# EAGLE design motherboard (EAGLE 5.06)
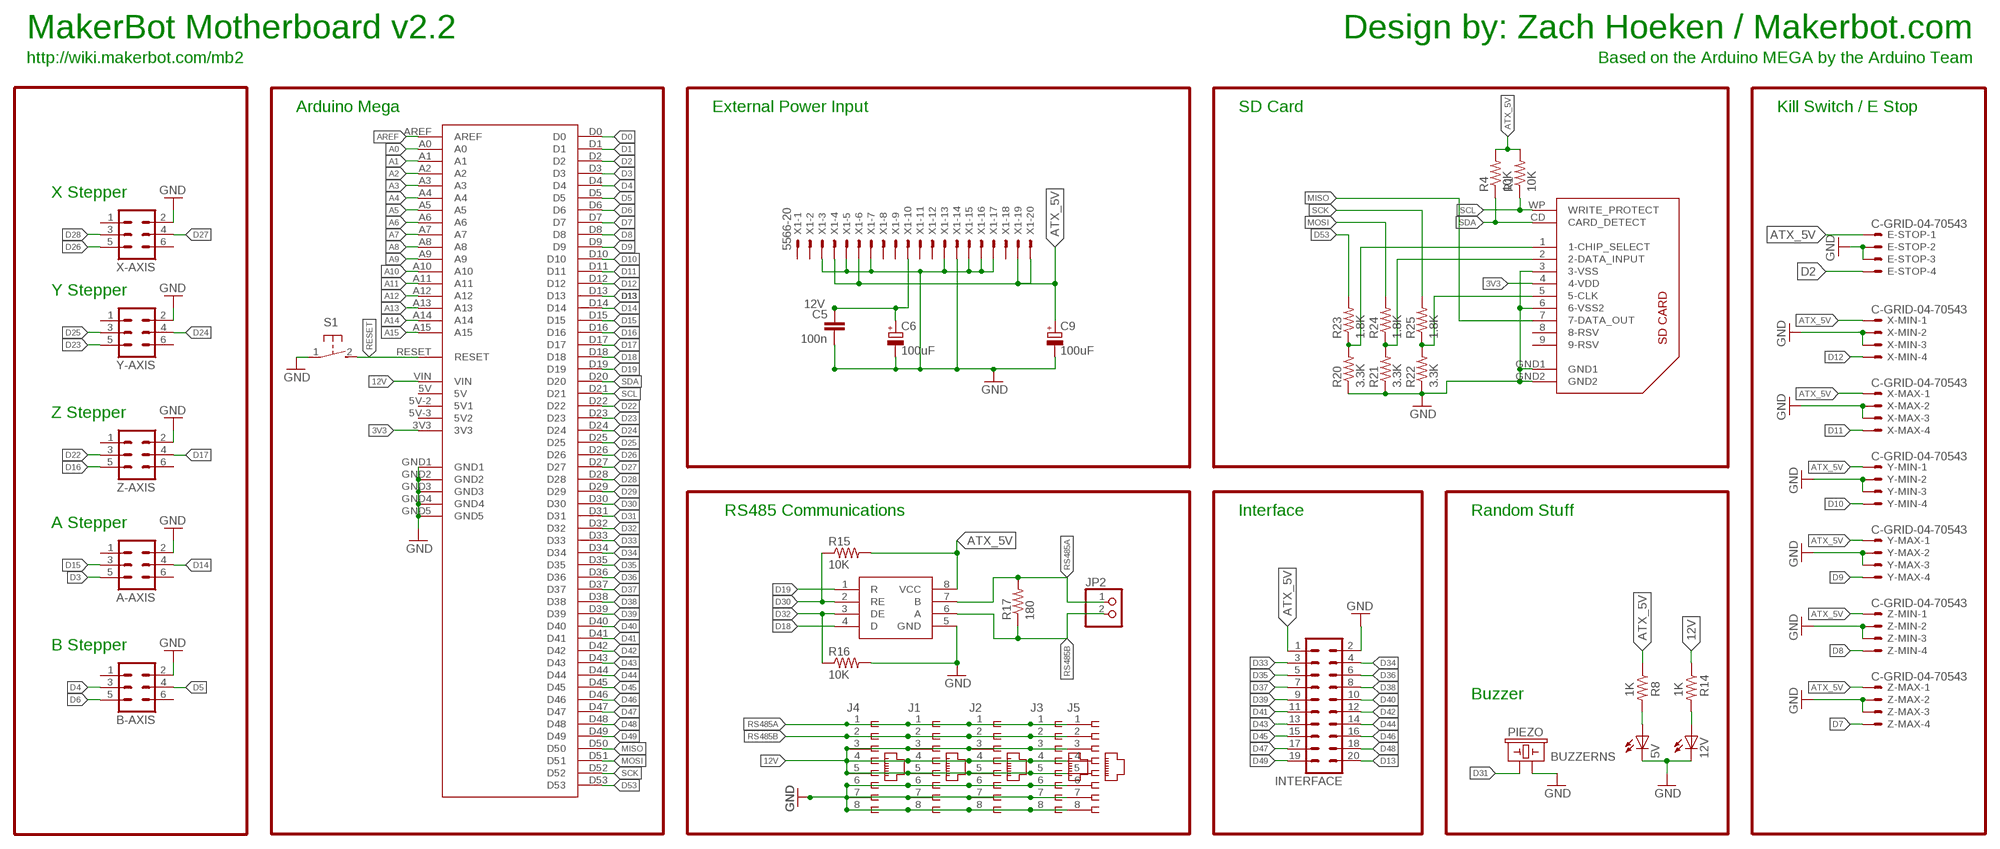
[diagram p0: schematic, sheet 1]

## Parts
5V  LED0805  [LED-0805]
12V  LED0805  [LED-0805]
A-AXIS  ML6  [ML6]
B-AXIS  ML6  [ML6]
C5  100n  CAP0805  [0805]
C6  100uF  CPOL-EUE3.5-8  [E3,5-8]
C9  100uF  CPOL-EUE3.5-8  [E3,5-8]
E-STOP  C-GRID-04-70543  [70543-04]
IC1  SN75176ASOIC  [SO08]
INTERFACE  ML20  [ML20]
J1  556416-1  [556416-1]
J2  556416-1  [556416-1]
J3  556416-1  [556416-1]
J4  556416-1  [556416-1]
J5  556416-1  [556416-1]
JP2  PINHD-1X2  [1X02]
PIEZO  BUZZERNS  [BUZZER-12MM-NS]
R1  10K  RESISTOR  [0805]
R4  10K  RESISTOR  [0805]
R8  1K  RESISTOR  [0805]
R14  1K  RESISTOR  [0805]
R15  10K  RESISTOR  [0805]
R16  10K  RESISTOR  [0805]
R17  180  RESISTOR  [0805]
R20  3.3K  RESISTOR  [0805]
R21  3.3K  RESISTOR  [0805]
R22  3.3K  RESISTOR  [0805]
R23  1.8K  RESISTOR  [0805]
R24  1.8K  RESISTOR  [0805]
R25  1.8K  RESISTOR  [0805]
S1  31-XX  [B3F-31XX]
U$1  ARDUINO-MEGA  [ARDUINO-MEGA]
U$2  SDCARD  [3M-SDCARD]
X1  5566-20  [5566-20]
X-AXIS  ML6  [ML6]
X-MAX  C-GRID-04-70543  [70543-04]
X-MIN  C-GRID-04-70543  [70543-04]
Y-AXIS  ML6  [ML6]
Y-MAX  C-GRID-04-70543  [70543-04]
Y-MIN  C-GRID-04-70543  [70543-04]
Z-AXIS  ML6  [ML6]
Z-MAX  C-GRID-04-70543  [70543-04]
Z-MIN  C-GRID-04-70543  [70543-04]

## Nets
3V3: U$1.3V3 U$2.4(4-VDD)
12V [power]: C5.1 C6.+ J1.3 J1.4 J1.5 J2.3 J2.4 J2.5 J3.3 J3.4 J3.5 J4.3 J4.4 J4.5 J5.3 J5.4 J5.5 R14.1 U$1.VIN X1.10
A0: U$1.A0
A1: U$1.A1
A2: U$1.A2
A3: U$1.A3
A4: U$1.A4
A5: U$1.A5
A6: U$1.A6
A7: U$1.A7
A8: U$1.A8
A9: U$1.A9
A10: U$1.A10
A11: U$1.A11
A12: U$1.A12
A13: U$1.A13
A14: U$1.A14
A15: U$1.A15
AREF: U$1.AREF
ATX_5V [usbvcc]: C9.+ E-STOP.1 IC1.8(VCC) INTERFACE.1 R1.2 R4.2 R8.1 R15.2 X1.4 X1.6 X1.19 X1.20 X-MAX.1 X-MIN.1 Y-MAX.1 Y-MIN.1 Z-MAX.1 Z-MIN.1
D0: U$1.D0
D1: U$1.D1
D2: E-STOP.4 U$1.D2
D3: A-AXIS.5 U$1.D3
D4: B-AXIS.3 U$1.D4
D5: B-AXIS.4 U$1.D5
D6: B-AXIS.5 U$1.D6
D7: U$1.D7 Z-MAX.4
D8: U$1.D8 Z-MIN.4
D9: U$1.D9 Y-MAX.4
D10: U$1.D10 Y-MIN.4
D11: U$1.D11 X-MAX.4
D12: U$1.D12 X-MIN.4
D13: INTERFACE.20 U$1.D13
D14: A-AXIS.4 U$1.D14
D15: A-AXIS.3 U$1.D15
D16: U$1.D16 Z-AXIS.5
D17: U$1.D17 Z-AXIS.4
D18: IC1.4(D) U$1.D18
D19: IC1.1(R) U$1.D19
D22: U$1.D22 Z-AXIS.3
D23: U$1.D23 Y-AXIS.5
D24: U$1.D24 Y-AXIS.4
D25: U$1.D25 Y-AXIS.3
D26: U$1.D26 X-AXIS.5
D27: U$1.D27 X-AXIS.4
D28: U$1.D28 X-AXIS.3
D29: U$1.D29
D30: IC1.2(RE) R15.1 U$1.D30
D31: PIEZO.+ U$1.D31
D32: IC1.3(DE) R16.1 U$1.D32
D33: INTERFACE.3 U$1.D33
D34: INTERFACE.4 U$1.D34
D35: INTERFACE.5 U$1.D35
D36: INTERFACE.6 U$1.D36
D37: INTERFACE.7 U$1.D37
D38: INTERFACE.8 U$1.D38
D39: INTERFACE.9 U$1.D39
D40: INTERFACE.10 U$1.D40
D41: INTERFACE.11 U$1.D41
D42: INTERFACE.12 U$1.D42
D43: INTERFACE.13 U$1.D43
D44: INTERFACE.14 U$1.D44
D45: INTERFACE.15 U$1.D45
D46: INTERFACE.16 U$1.D46
D47: INTERFACE.17 U$1.D47
D48: INTERFACE.18 U$1.D48
D49: INTERFACE.19 U$1.D49
D53: R23.2 U$1.D53
GND [gnd]: 5V.C 12V.C A-AXIS.2 B-AXIS.2 C5.2 C6.- C9.- E-STOP.2 E-STOP.3 IC1.5(GND) INTERFACE.2 J1.6 J1.7 J1.8 J2.6 J2.7 J2.8 J3.6 J3.7 J3.8 J4.6 J4.7 J4.8 J5.6 J5.7 J5.8 PIEZO.- R16.2 R20.1 R21.1 R22.1 S1.1(P) U$1.GND1 U$1.GND2 U$1.GND3 U$1.GND4 U$1.GND5 U$2.3(3-VSS) U$2.6(6-VSS2) U$2.GND1 U$2.GND2 X1.3 X1.5 X1.7 X1.13 X1.14 X1.15 X1.16 X1.17 X-AXIS.2 X-MAX.2 X-MAX.3 X-MIN.2 X-MIN.3 Y-AXIS.2 Y-MAX.2 Y-MAX.3 Y-MIN.2 Y-MIN.3 Z-AXIS.2 Z-MAX.2 Z-MAX.3 Z-MIN.2 Z-MIN.3
MISO: U$1.D50 U$2.7(7-DATA_OUT)
MOSI: R24.2 U$1.D51
N$3: 5V.A R8.2
N$4: R22.2 R25.1 U$2.5(5-CLK)
N$5: R21.2 R24.1 U$2.2(2-DATA_INPUT)
N$10: 12V.A R14.2
N$11: R20.2 R23.1 U$2.1(1-CHIP_SELECT)
RESET: S1.2(S) U$1.RESET
RS485A: IC1.7(B) J1.1 J2.1 J3.1 J4.1 J5.1 JP2.1 R17.2
RS485B: IC1.6(A) J1.2 J2.2 J3.2 J4.2 J5.2 JP2.2 R17.1
SCK: R25.2 U$1.D52
SCL: R1.1 U$1.D21 U$2.WP(WRITE_PROTECT)
SDA: R4.1 U$1.D20 U$2.CD(CARD_DETECT)
Unconnected: A-AXIS.1 A-AXIS.6 B-AXIS.1 B-AXIS.6 U$1.5V U$1.5V-2(5V1) U$1.5V-3(5V2) U$2.8(8-RSV) U$2.9(9-RSV) X1.1 X1.2 X1.8 X1.9 X1.11 X1.12 X1.18 X-AXIS.1 X-AXIS.6 Y-AXIS.1 Y-AXIS.6 Z-AXIS.1 Z-AXIS.6

## Notes on the sheet
- Design by: Zach Hoeken / Makerbot.com
- MakerBot Motherboard v2.2
- Based on the Arduino MEGA by the Arduino Team
- http://wiki.makerbot.com/mb2
- Arduino Mega | External Power Input | SD Card | Kill Switch / E Stop
- X Stepper
- Y Stepper
- Z Stepper
- RS485 Communications | Interface | Random Stuff
- A Stepper
- B Stepper
- Buzzer

## Library data of the parts
5V 12V = SparkFun:LED: LEDs Standard schematic elements and footprints for 5mm, 3mm, 1206, and 0603 sized LEDs. 5mm - Spark Fun Electronics SKU : COM-00529 (and others)
A-AXIS B-AXIS X-AXIS Y-AXIS Z-AXIS = con-ml:ML6: HARTING
C5 = SparkFun:CAP: Capacitor Standard 0603 ceramic capacitor, and 0.1" leaded capacitor.
C6 C9 = resistor:CPOL-EU: POLARIZED CAPACITOR, European symbol
E-STOP X-MAX X-MIN Y-MAX Y-MIN Z-MAX Z-MIN = con-molex:C-GRID-04: CONNECTOR wire to board 2.54 mm (0.100") pitch header
IC1 = reprap:SN75176A
INTERFACE = con-harting-ml:ML20: HARTING
J1-J5 = con-amp:556416-1: AMP connector
JP2 = pinhead:PINHD-1X2: PIN HEADER
PIEZO = SparkFun:BUZZER: Buzzer 12mm Spark Fun Electronics SKU : Comp-Buzzer
R1 R4 R8 R14-R17 R20-R25 = SparkFun:RESISTOR: Resistor Basic schematic elements and footprints for 0603, 1206, and PTH 1/10th watt (small) resistors.
S1 = switch-omron:31-XX: OMRON SWITCH
U$1 = MakerBot:ARDUINO-MEGA
U$2 = reprap:SDCARD
X1 = con-molex:5566-20: Mini FIT connector 20 pol ATX PC-Motherboard Power connector Source: http://www.molex.com

## Net classes
0 default: width 0.203 mm, drill 0.406 mm, clearance 0.203 mm
1 power: width 0.61 mm, drill 0.711 mm, clearance 0.203 mm
2 gnd: width 0.305 mm, drill 0.711 mm, clearance 0.203 mm
3 usbvcc: width 0.508 mm, drill 0.711 mm, clearance 0.203 mm

## Board
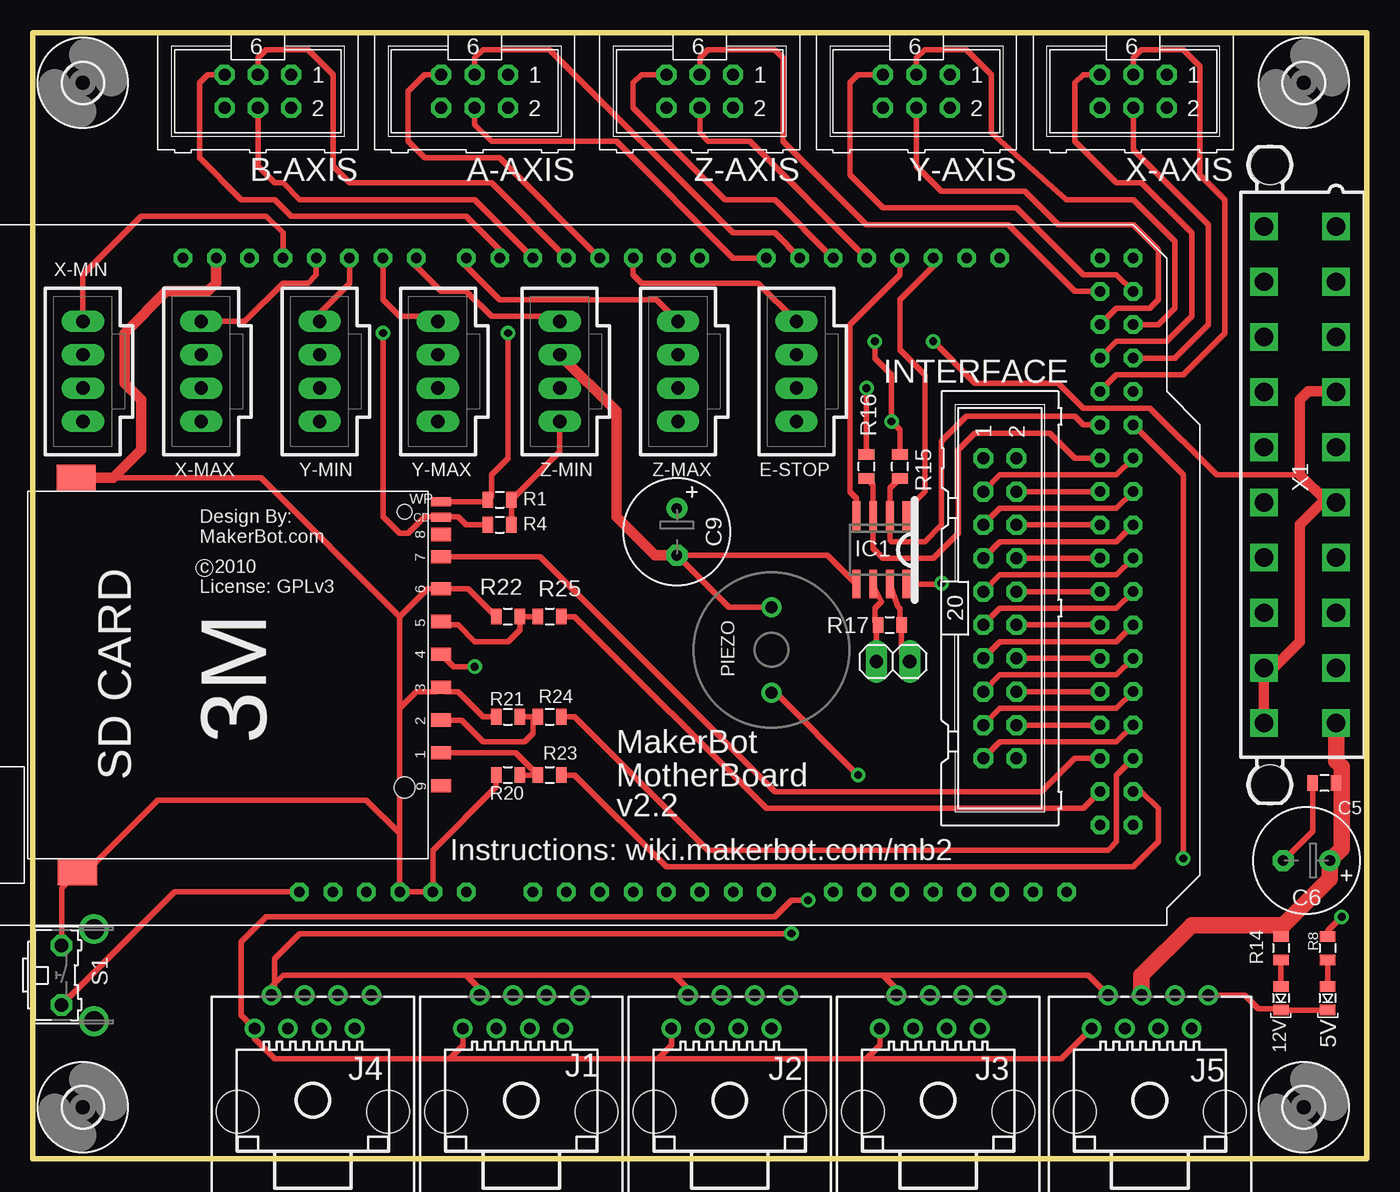
[diagram p1: board, top side]
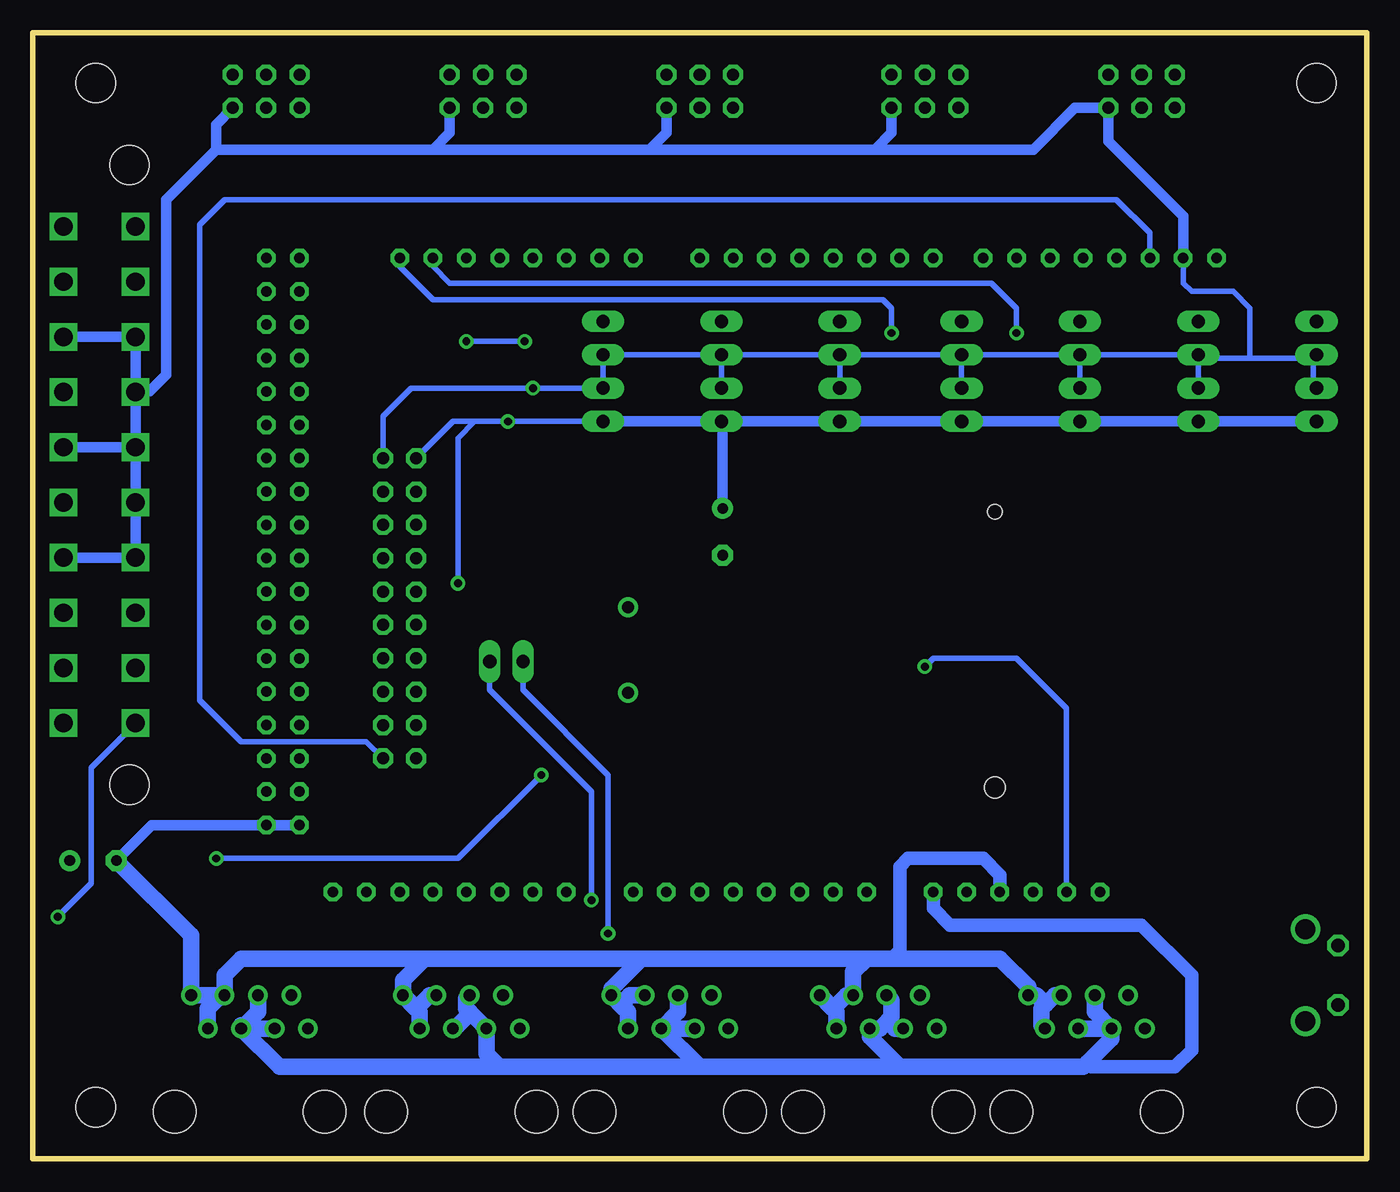
[diagram p2: board, bottom side, seen from below]

Size 101.6 x 85.72 mm. Coordinates in mm from the lower left corner, seen from the top.
Outline: 0,0 101.6,0 101.6,85.72 0,85.72 0,0
Copper layers (1*16): Top 0.035mm / dielectric 1.5mm / Bottom 0.035mm
Design rules "SparkFun": minimum track width 8mil, minimum drill 20mil, track to track 8mil, track to pad 8mil, pad to pad 8mil, via to via 8mil, smd to smd 8mil, copper to edge 10mil, drill to drill 8mil, minimum pad ring 12mil, minimum via ring 10mil, stop-mask expansion 4mil, vias tented up to drill 25mil, thermal gap 10mil

### Footprints (pad centres in the part's own frame; a part is rotated, then mirrored left to right if it is on the bottom)
LED-0805 = smd 1.2 x 0.8: A 0,-0.9; C 0,0.9
ML6 = drill 0.914 octagon: 1 -2.54,-1.27; 2 -2.54,1.27; 3 0,-1.27; 4 0,1.27; 5 2.54,-1.27; 6 2.54,1.27
0805 = smd 0.8 x 1.2: 1 -0.9,0; 2 0.9,0
E3,5-8 = drill 0.813 pad 1.6 round: + -1.778,0 | drill 0.813 pad 1.6 octagon: - 1.778,0
70543-04 = drill 1.016 long: 1 -3.81,0; 2 -1.27,0; 3 1.27,0; 4 3.81,0
SO08 = smd 0.6 x 2.2: 1 -1.905,-2.6; 2 -0.635,-2.6; 3 0.635,-2.6; 4 1.905,-2.6; 5 1.905,2.6; 6 0.635,2.6; 7 -0.635,2.6; 8 -1.905,2.6
ML20 = drill 0.914 octagon: 1 -11.43,-1.27; 2 -11.43,1.27; 3 -8.89,-1.27; 4 -8.89,1.27; 5 -6.35,-1.27; 6 -6.35,1.27; 7 -3.81,-1.27; 8 -3.81,1.27; 9 -1.27,-1.27; 10 -1.27,1.27; 11 1.27,-1.27; 12 1.27,1.27; 13 3.81,-1.27; 14 3.81,1.27; 15 6.35,-1.27; 16 6.35,1.27; 17 8.89,-1.27; 18 8.89,1.27; 19 11.43,-1.27; 20 11.43,1.27
556416-1 = drill 0.889 round: 1 -4.445,5.461; 2 -3.175,8.001; 3 -1.905,5.461; 4 -0.635,8.001; 5 0.635,5.461; 6 1.905,8.001; 7 3.175,5.461; 8 4.445,8.001 | hole 3.251: -5.715,-0.889; 5.715,-0.889
1X02 = drill 1.016 long: 1 -1.27,0; 2 1.27,0
BUZZER-12MM-NS = drill 0.9 round: + 3.25,0; - -3.25,0
B3F-31XX = drill 1.016 octagon: 1 -2.261,-1.245; 2 2.261,-1.245 | drill 1.499 pad 2.159 round: 3 -3.505,1.245; 4 3.505,1.245
ARDUINO-MEGA = drill 0.8 octagon: 3V3 35.56,2.54; 5V 93.98,50.8; 5V-2 96.52,50.8; 5V-3 38.1,2.54; A0 50.8,2.54; A1 53.34,2.54; A2 55.88,2.54; A3 58.42,2.54; A4 60.96,2.54; A5 63.5,2.54; A6 66.04,2.54; A7 68.58,2.54; A8 73.66,2.54; A9 76.2,2.54; A10 78.74,2.54; A11 81.28,2.54; A12 83.82,2.54; A13 86.36,2.54; A14 88.9,2.54; A15 91.44,2.54; AREF 24.13,50.8; D0 63.5,50.8; D1 60.96,50.8; D2 58.42,50.8; D3 55.88,50.8; D4 53.34,50.8; D5 50.8,50.8; D6 48.26,50.8; D7 45.72,50.8; D8 41.91,50.8; D9 39.37,50.8; D10 36.83,50.8; D11 34.29,50.8; D12 31.75,50.8; D13 29.21,50.8; D14 68.58,50.8; D15 71.12,50.8; D16 73.66,50.8; D17 76.2,50.8; D18 78.74,50.8; D19 81.28,50.8; D20 83.82,50.8; D21 86.36,50.8; D22 93.98,48.26; D23 96.52,48.26; D24 93.98,45.72; D25 96.52,45.72; D26 93.98,43.18; D27 96.52,43.18; D28 93.98,40.64; D29 96.52,40.64; D30 93.98,38.1; D31 96.52,38.1; D32 93.98,35.56; D33 96.52,35.56; D34 93.98,33.02; D35 96.52,33.02; D36 93.98,30.48; D37 96.52,30.48; D38 93.98,27.94; D39 96.52,27.94; D40 93.98,25.4; D41 96.52,25.4; D42 93.98,22.86; D43 96.52,22.86; D44 93.98,20.32; D45 96.52,20.32; D46 93.98,17.78; D47 96.52,17.78; D48 93.98,15.24; D49 96.52,15.24; D50 93.98,12.7; D51 96.52,12.7; D52 93.98,10.16; D53 96.52,10.16; GND1 26.67,50.8; GND2 93.98,7.62; GND3 96.52,7.62; GND4 40.64,2.54; GND5 43.18,2.54; RESET 33.02,2.54; VIN 45.72,2.54
3M-SDCARD = smd 1 x 1.5: 1 5.93,16.5; 2 3.43,16.5; 3 0.93,16.5; 4 -1.57,16.5; 5 -4.07,16.5; 6 -6.57,16.5; 7 -9,16.5; 8 -10.7,16.5; 9 8.43,16.5 | smd 0.7 x 1.5: CD -12,16.5; WP -13.2,16.5 | smd 2 x 3: GND1 -15,-11.3; GND2 15,-11.2 | hole 1.1: -12.427,13.705 | hole 1.6: 8.567,13.708
3,0 = hole 3: 0,0
5566-20 = drill 1.4 square: 1 18.9,-2.75; 2 14.7,-2.75; 3 10.5,-2.75; 4 6.3,-2.75; 5 2.1,-2.75; 6 -2.1,-2.75; 7 -6.3,-2.75; 8 -10.5,-2.75; 9 -14.7,-2.75; 10 -18.9,-2.75; 11 18.9,2.75; 12 14.7,2.75; 13 10.5,2.75; 14 6.3,2.75; 15 2.1,2.75; 16 -2.1,2.75; 17 -6.3,2.75; 18 -10.5,2.75; 19 -14.7,2.75; 20 -18.9,2.75 | hole 3: 23.6,2.29; -23.6,2.29

### Placement (x,y rotation side)
5V  98.63,12.22 180 top
12V  95.07,12.22 180 top
A-AXIS  33.66,81.28 180 top
B-AXIS  17.14,81.28 180 top
C5  98.38,28.6 180 top
C6  97.01,22.7 180 top
C9  49.05,47.73 270 top
E-STOP  58.17,59.94 90 top
IC1  64.64,46.35 180 top
INTERFACE  73.66,41.91 270 top
J1  37.21,4.45 0 top
J2  53.09,4.45 0 top
J3  68.96,4.45 0 top
J4  21.34,4.45 0 top
J5  85.09,4.45 0 top
JP2  65.53,37.85 180 top
PIEZO  56.26,38.73 270 top
R1  35.56,50.16 0 top
R4  35.56,48.26 0 top
R8  98.63,16.03 270 top
R14  95.07,16.03 270 top
R15  66.04,52.7 90 top
R16  63.5,52.7 90 top
R17  65.28,40.64 0 top
R20  36.2,29.21 0 top
R21  36.2,33.66 0 top
R22  36.2,41.27 0 top
R23  39.37,29.21 0 top
R24  39.37,33.66 0 top
R25  39.37,41.27 0 top
S1  3.43,13.97 270 top
U$1  -12.7,17.78 0 top
U$2  14.61,36.83 270 top
U$4  [3,0]  3.81,81.92 0 top
U$5  [3,0]  96.81,81.92 0 top
U$6  [3,0]  96.81,3.92 0 top
U$7  [3,0]  3.81,3.92 0 top
X1  96.52,52.07 90 top
X-AXIS  83.82,81.28 180 top
X-MAX  12.83,59.94 90 top
X-MIN  3.81,59.94 90 top
Y-AXIS  67.31,81.28 180 top
Y-MAX  30.86,59.94 90 top
Y-MIN  21.84,59.94 90 top
Z-AXIS  50.8,81.28 180 top
Z-MAX  49.15,59.94 90 top
Z-MIN  40.13,59.94 90 top

### Tracks (layer width: path | path; a pad name or v marks a point on that pad's centre or on a via)
3V3  (via drill 0.6)
  Top 0.406: v33.66,37.47 32.04,37.47 U$2.4
  Bottom 0.406: U$1.3V3 22.86,34.29 26.67,38.1 33.02,38.1 v33.66,37.47
12V
  Top 0.406: C5.1 99.28,28.79 99.69,29.21 | R14.1 95.07,17.6 95.25,17.78
  Top 1.27: X1.10 99.27,30.27 99.69,29.84 99.69,29.21 99.69,23.61 C6.+ 98.79,21.32 95.25,17.78 88.27,17.78 84.45,13.97 J5.4
  Bottom 1.016: U$1.VIN 33.02,19.05 31.75,17.78 17.14,17.78 13.34,13.97 13.34,8.26 14.61,6.99 20.95,6.99 21.27,7.3
  Bottom 1.27: J4.3 19.43,9.14 21.27,7.3 21.59,6.99 35.56,6.99 | 35.56,6.99 50.8,6.99 | 50.8,6.99 66.04,6.99 | 66.04,6.99 82.8,6.99 J5.5 | J5.5 J5.3 | J5.5 85.72,10.16 | 68.26,11.11 J3.3 67.06,8 66.04,6.99 | 68.26,11.11 68.58,11.43 68.58,12.19 J3.4 | J3.5 69.47,9.91 68.26,11.11 | J2.4 52.45,11.18 J2.5 | J2.5 J2.3 | 50.8,6.99 J2.5 | 36.51,10.48 37.08,9.91 J1.5 37.85,9.27 35.56,6.99 | 36.51,10.48 36.2,10.79 36.2,12.06 J1.4 | J1.3 35.94,9.91 36.51,10.48 | J4.4 20.7,11.18 J4.3 | J4.3 J4.5 | J5.4 84.45,11.18 J5.5
ATX_5V  (via drill 0.6)
  Top 0.406: Z-MIN.1 40.13,53.84 R1.2 R4.2 | R15.2 66.04,55.5 v65.41,56.13 65.41,59.69 64.14,60.96 v64.14,62.23 | R8.1 98.63,17.35 v99.69,18.41 | IC1.8 69.16,43.76 v69.22,43.81 | 96.52,52.07 90.17,52.07 85.09,57.15 80.01,57.15 78.11,59.05 71.75,59.05 v68.58,62.23
  Top 0.813: X1.20 X1.19 94.52,37.37 96.52,39.37 96.52,48.26 98.42,50.16 99.08,50.16 X1.6 98.62,49.97 96.52,52.07 96.52,57.78 97.16,58.42 99.22,58.42 X1.4
  Bottom 0.406: 67.94,56.13 v65.41,56.13 E-STOP.1 | 67.94,56.13 69.6,56.13 INTERFACE.1 | v99.69,18.41 97.16,20.95 97.16,29.79 X1.20 | v69.22,43.81 69.22,54.86 67.94,56.13 | v64.14,62.23 v68.58,62.23
  Bottom 0.813: X-MIN.1 X-MAX.1 Y-MIN.1 Y-MAX.1 Z-MIN.1 Z-MAX.1 | Z-MAX.1 E-STOP.1 | C9.+ 49.05,56.04 Z-MAX.1
D2
  Top 0.406: U$1.D2 45.72,67.31 46.35,66.67 55.24,66.67 E-STOP.4
D3
  Top 0.406: U$1.D3 35.56,76.2 29.84,76.2 28.57,77.47 28.57,81.28 29.84,82.55 A-AXIS.5
D4
  Top 0.406: U$1.D4 34.92,74.3 24.13,74.3 22.86,75.56 22.86,82.55 20.95,84.45 17.78,84.45 17.14,83.82 B-AXIS.3
D5
  Top 0.406: U$1.D5 33.66,73.03 20.32,73.03 19.05,74.3 18.41,74.3 17.14,75.56 B-AXIS.4
D6
  Top 0.406: U$1.D6 35.56,69.22 33.02,71.75 19.68,71.75 18.41,73.03 15.88,73.03 12.7,76.2 12.7,81.92 13.34,82.55 B-AXIS.5
D7
  Top 0.406: U$1.D7 33.02,67.94 35.56,65.41 47.5,65.41 Z-MAX.4
D8
  Top 0.406: U$1.D8 29.21,67.94 31.11,66.04 33.02,66.04 34.92,64.14 39.75,64.14 Z-MIN.4
D9
  Top 0.406: U$1.D9 26.67,65.41 27.94,64.14 30.48,64.14 Y-MAX.4
D10
  Top 0.406: Y-MIN.4 21.84,64.39 24.13,66.67 U$1.D10
D11
  Top 0.406: X-MAX.4 16.13,63.75 19.05,66.67 20.95,66.67 21.59,67.31 U$1.D11
D12
  Top 0.406: X-MIN.4 3.81,67.31 8.26,71.75 17.78,71.75 19.05,70.48 U$1.D12
D13
  Bottom 0.406: U$1.D13 16.51,70.48 19.05,73.03 87,73.03 88.9,71.12 88.9,34.92 85.72,31.75 76.2,31.75 INTERFACE.20
D14
  Top 0.406: U$1.D14 53.34,68.58 44.45,77.47 34.92,77.47 33.66,78.74 A-AXIS.4
D15
  Top 0.406: U$1.D15 56.52,70.48 53.34,70.48 39.37,84.45 34.29,84.45 33.66,83.82 A-AXIS.3
D16
  Top 0.406: U$1.D16 56.52,73.03 52.7,73.03 45.72,80.01 45.72,81.92 46.35,82.55 Z-AXIS.5
D17
  Top 0.406: U$1.D17 54.61,77.47 51.44,77.47 50.8,78.11 Z-AXIS.4
D18
  Top 0.406: U$1.D18 66.04,67.31 62.23,63.5 62.23,50.8 62.74,50.29 IC1.4
D19
  Top 0.406: U$1.D19 68.58,67.94 66.04,65.41 66.04,61.59 67.94,59.69 67.94,50.8 66.55,49.4 IC1.1
D22
  Top 0.406: U$1.D22 79.38,66.04 74.3,71.12 63.5,71.12 57.15,77.47 57.15,83.82 56.52,84.45 51.44,84.45 50.8,83.82 Z-AXIS.3
D23
  Top 0.406: Y-AXIS.5 62.87,82.55 62.23,81.92 62.23,74.93 64.77,72.39 74.93,72.39 80.01,67.31 82.55,67.31 U$1.D23
D24
  Top 0.406: U$1.D24 82.55,64.77 85.09,64.77 85.72,65.41 85.72,69.22 83.82,71.12 78.11,71.12 75.56,73.66 69.22,73.66 67.31,75.56 Y-AXIS.4
D25
  Top 0.406: U$1.D25 85.72,63.5 87,64.77 87,69.85 83.82,73.03 78.74,73.03 73.03,78.11 73.03,82.55 71.12,84.45 67.94,84.45 67.31,83.82 Y-AXIS.3
D26
  Top 0.406: U$1.D26 82.55,62.23 86.36,62.23 88.27,64.14 88.27,70.48 84.45,74.3 82.55,74.3 79.38,77.47 79.38,81.92 80.01,82.55 X-AXIS.5
D27
  Top 0.406: U$1.D27 87,60.96 89.53,63.5 89.53,71.12 83.82,76.83 X-AXIS.4
D28
  Top 0.406: U$1.D28 82.55,59.69 87.63,59.69 90.81,62.87 90.81,73.03 88.9,74.93 88.9,83.19 87.63,84.45 84.45,84.45 83.82,83.82 X-AXIS.3
D30
  Top 0.406: U$1.D30 80.01,55.88 79.38,56.52 71.12,56.52 69.22,54.61 69.22,48.26 67.94,46.99 65.41,46.99 65.28,47.12 IC1.2 65.28,51.04 R15.1
D31  (via drill 0.6)
  Top 0.406: PIEZO.+ 56.59,35.48 v62.87,29.21 | v87.63,22.86 87.63,52.07 U$1.D31
  Bottom 0.406: v62.87,29.21 69.22,22.86 v87.63,22.86
D32
  Top 0.406: U$1.D32 79.38,53.34 77.47,55.24 71.75,55.24 70.48,53.98 70.48,47.62 68.58,45.72 64.77,45.72 64.01,46.48 IC1.3 64.01,51.3 R16.1
D33
  Top 0.406: INTERFACE.3 73.66,52.07 82.55,52.07 U$1.D33
D34
  Top 0.406: INTERFACE.4 U$1.D34
D35
  Top 0.406: INTERFACE.5 73.66,49.53 82.55,49.53 U$1.D35
D36
  Top 0.406: INTERFACE.6 U$1.D36
D37
  Top 0.406: INTERFACE.7 73.66,46.99 82.55,46.99 U$1.D37
D38
  Top 0.406: INTERFACE.8 U$1.D38
D39
  Top 0.406: INTERFACE.9 73.66,44.45 82.55,44.45 U$1.D39
D40
  Top 0.406: INTERFACE.10 U$1.D40
D41
  Top 0.406: INTERFACE.11 73.66,41.91 82.55,41.91 U$1.D41
D42
  Top 0.406: INTERFACE.12 U$1.D42
D43
  Top 0.406: INTERFACE.13 73.66,39.37 82.55,39.37 U$1.D43
D44
  Top 0.406: INTERFACE.14 U$1.D44
D45
  Top 0.406: INTERFACE.15 73.66,36.83 82.55,36.83 U$1.D45
D46
  Top 0.406: INTERFACE.16 U$1.D46
D47
  Top 0.406: INTERFACE.17 73.66,34.29 82.55,34.29 U$1.D47
D48
  Top 0.406: INTERFACE.18 U$1.D48
D49
  Top 0.406: INTERFACE.19 73.66,31.75 82.55,31.75 U$1.D49
D53
  Top 0.406: U$1.D53 84.45,27.94 85.72,26.67 85.72,24.13 83.82,22.23 48.26,22.23 41.27,29.21 R23.2
GND  (via drill 0.6)
  Top 0.406: R22.1 33.17,43.4 U$2.6 30.07,43.4 27.94,41.27 | R21.1 34.29,33.66 32.38,35.56 31.45,35.56 U$2.3 30.77,35.56 29.21,35.56 27.94,34.29 | R20.1 35.3,28.31 30.48,23.5 U$1.GND5 U$1.GND4 27.94,24.77 | 27.94,24.77 27.94,34.29 | 27.94,34.29 27.94,41.27 | U$2.GND1 17.39,51.83 27.94,41.27 | 27.94,24.77 25.4,27.3 9.53,27.3 4.05,21.83 U$2.GND2 2.18,20.61 S1.1 | v63.5,58.67 R16.2 | C5.2 97.48,24.95 C6.- | 5V.C 12V.C 94.96,11.43 93.34,11.43 92.33,12.45 J5.8 | IC1.5 60.54,45.95 C9.- 53.02,41.98 PIEZO.-
  Top 0.813: C9.- 47.39,45.95 44.45,48.9 44.45,56.9 Z-MIN.3 | U$2.GND1 6.11,51.83 8.26,53.98 8.26,57.78 6.99,59.05 6.99,62.87 10.16,66.04 13.34,66.04 13.97,66.67 U$1.GND1
  Bottom 0.406: X-AXIS.2 86.17,80.01 | U$1.GND1 13.97,66.67 13.34,66.04 10.16,66.04 8.89,64.77 8.89,60.96 | 8.89,60.96 4.06,60.96 | 4.06,60.96 X-MIN.3 | 8.89,60.96 12.57,60.96 X-MAX.3 13.34,61.21 | 13.34,61.21 Y-MIN.3 | Y-MIN.3 Y-MAX.3 | Y-MAX.3 Z-MIN.3 | Z-MIN.3 Z-MAX.3 | Z-MAX.3 E-STOP.3 E-STOP.2 v63.5,58.67 71.12,58.67 72.77,58.67 74.93,56.52 INTERFACE.2 | 4.06,60.96 4.06,58.93 X-MIN.2 | X-MAX.2 12.83,60.71 13.34,61.21 | Y-MIN.3 Y-MIN.2 | Y-MAX.3 Y-MAX.2 | Z-MIN.3 Z-MIN.2 | Z-MAX.3 Z-MAX.2
  Bottom 0.813: U$1.GND2 U$1.GND3 92.53,25.4 C6.- | X1.7 X1.17 X1.16 X1.15 | X1.15 X1.5 | X1.14 X1.15 | X1.14 X1.13 X1.3 | U$1.GND1 13.97,71.75 19.68,77.47 B-AXIS.2 22.23,80.01 25.4,76.83 37.47,76.83 | 37.47,76.83 54.61,76.83 | 54.61,76.83 71.12,76.83 | 71.12,76.83 87.63,76.83 | 87.63,76.83 91.44,73.03 91.44,59.69 92.71,58.42 93.72,58.42 X1.14 | 87.63,76.83 87.63,78.74 X-AXIS.2 | Y-AXIS.2 69.85,78.11 71.12,76.83 | Z-AXIS.2 53.34,78.11 54.61,76.83 | A-AXIS.2 36.2,78.11 37.47,76.83
  Bottom 1.016: U$1.GND4 27.94,21.59 29.21,22.86 34.92,22.86 35.56,22.23 35.56,15.88 36.2,15.24
  Bottom 1.27: J4.6 23.75,12.45 24.45,11.75 | 24.45,11.75 24.77,11.43 24.77,10.16 J4.7 | 24.45,11.75 25.15,12.45 J4.8 25.78,13.08 27.94,15.24 36.2,15.24 38.1,15.24 | 38.1,15.24 55.24,15.24 | 55.24,15.24 71.75,15.24 | 71.75,15.24 85.72,15.24 87,13.97 J5.6 | J5.6 87.25,12.45 88.27,11.43 J5.7 | J5.6 J5.8 89.53,17 C6.- | J3.7 72.14,11.18 72.39,11.43 | 72.39,11.43 J3.8 73.41,13.59 71.75,15.24 | J3.6 71.37,12.45 72.39,11.43 | J2.7 56.26,11.18 56.52,11.43 | 56.52,11.43 J2.8 57.53,12.95 55.24,15.24 | J2.6 56.13,12.45 56.52,12.06 56.52,11.43 | J1.7 40.39,11.18 40.64,11.43 | 40.64,11.43 J1.8 | 40.64,11.43 39.62,12.45 J1.6 39.12,14.22 38.1,15.24
MISO
  Top 0.406: U$2.7 38.62,45.83 56.52,27.94 76.83,27.94 79.38,30.48 U$1.D50
MOSI
  Top 0.406: R24.2 41.27,33.66 51.44,23.5 81.92,23.5 82.55,24.13 82.55,29.21 U$1.D51
N$3
  Top 0.406: R8.2 5V.A
N$4
  Top 0.406: R25.1 R22.2 37.09,40.27 36.2,39.37 33.66,39.37 32.38,40.64 31.36,40.64 U$2.5
N$5
  Top 0.406: R21.2 R24.1 38.1,33.28 38.1,32.38 37.47,31.75 34.29,31.75 32.64,33.4 U$2.2
N$10
  Top 0.406: 12V.A R14.2
N$11
  Top 0.406: R20.2 R23.1 36.78,30.9 U$2.1
RESET
  Top 0.406: U$1.RESET 10.79,20.32 S1.2
RS485A  (via drill 0.6)
  Top 0.406: IC1.7 65.91,42.04 66.04,41.91 66.04,40.78 R17.2 66.18,38.47 JP2.1 | 31.75,7.62 18.41,7.62 16.89,9.14 J4.1 15.88,10.92 15.88,16.51 17.78,18.41 56.52,18.41 57.78,19.68 v59.05,19.68 | 31.75,7.62 47.62,7.62 | 47.62,7.62 63.5,7.62 | 63.5,7.62 78.36,7.62 J5.1 | J3.1 64.52,8.64 63.5,7.62 | J2.1 48.64,8.64 47.62,7.62 | J1.1 32.77,8.64 31.75,7.62
  Bottom 0.406: JP2.1 66.8,35.69 59.05,27.94 v59.05,19.68
RS485B  (via drill 0.6)
  Top 0.406: IC1.6 64.64,42.42 64.14,41.91 64.14,40.88 R17.1 64.26,40.52 JP2.2 | 33.02,13.97 19.05,13.97 18.16,13.08 J4.2 18.41,12.7 18.41,15.24 20.32,17.14 v57.78,17.14 | 33.02,13.97 48.9,13.97 | 48.9,13.97 64.77,13.97 | 64.77,13.97 80.39,13.97 J5.2 | J3.2 65.79,12.95 64.77,13.97 | J2.2 49.91,12.95 48.9,13.97 | J1.2 34.04,12.95 33.02,13.97
  Bottom 0.406: JP2.2 64.26,35.69 57.78,29.21 v57.78,17.14
SCK
  Top 0.406: R25.2 41.27,41.27 55.88,26.67 80.01,26.67 U$1.D52
SCL  (via drill 0.6)
  Top 0.406: U$2.WP 34.52,50.03 R1.1 34.92,50.43 34.92,52.07 36.2,53.34 v36.2,62.87
  Bottom 0.406: U$1.D21 73.66,67.94 71.12,65.41 36.83,65.41 36.2,64.77 v36.2,62.87
SDA  (via drill 0.6)
  Top 0.406: R4.1 33.02,48.26 32.38,48.9 31.17,48.9 U$2.CD 31.04,48.9 29.84,48.9 28.57,47.62 27.94,47.62 26.67,48.9 v26.67,62.87
  Bottom 0.406: U$1.D20 71.12,67.94 69.85,66.67 28.57,66.67 26.67,64.77 v26.67,62.87

### Text on the board
tPlace: Design By: | MakerBot.com | c 2010 | License: GPLv3 | PIEZO | MakerBot | MotherBoard | v2.2 | Instructions: wiki.makerbot.com/mb2